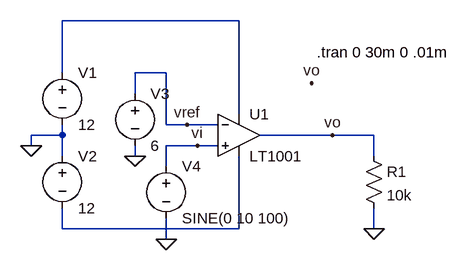
[diagram p0: schematic comparadores1.asc]
comparadores1.asc, the LTspice schematic file:
Version 4
SHEET 1 880 680
WIRE 176 16 -96 16
WIRE -96 96 -96 16
WIRE 64 96 16 96
WIRE 16 128 16 96
WIRE 176 160 176 16
WIRE 64 176 64 96
WIRE 96 176 64 176
WIRE 144 176 96 176
WIRE -96 192 -96 176
WIRE -96 192 -144 192
WIRE 320 192 208 192
WIRE 384 192 320 192
WIRE -144 208 -144 192
WIRE 112 208 64 208
WIRE 144 208 112 208
WIRE -96 224 -96 192
WIRE 16 224 16 208
WIRE 384 224 384 192
WIRE 64 240 64 208
WIRE -96 336 -96 304
WIRE 176 336 176 224
WIRE 176 336 -96 336
WIRE 384 336 384 304
WIRE 64 352 64 320
FLAG -144 208 0
FLAG 16 224 0
FLAG 64 352 0
FLAG 384 336 0
FLAG 320 192 vo
FLAG 288 112 vo
FLAG 96 176 vref
FLAG 112 208 vi
SYMBOL Opamps\\LT1001 176 128 R0
SYMATTR InstName U1
SYMBOL voltage -96 80 R0
WINDOW 123 0 0 Left 2
WINDOW 39 0 0 Left 2
SYMATTR InstName V1
SYMATTR Value 12
SYMBOL voltage -96 208 R0
WINDOW 123 0 0 Left 2
WINDOW 39 0 0 Left 2
SYMATTR InstName V2
SYMATTR Value 12
SYMBOL voltage 16 112 R0
WINDOW 123 0 0 Left 2
WINDOW 39 0 0 Left 2
SYMATTR InstName V3
SYMATTR Value 6
SYMBOL voltage 64 224 R0
WINDOW 123 0 0 Left 2
WINDOW 39 0 0 Left 2
SYMATTR InstName V4
SYMATTR Value SINE(0 10 100)
SYMBOL res 368 208 R0
SYMATTR InstName R1
SYMATTR Value 10k
TEXT 296 64 Left 2 !.tran 0 30m 0 .01m

The netlist it stands for:
* comparadores1.asc
XU1 vi vref N001 N002 vo LT1001  ; pins In+ In- V+ V- OUT
V1 N001 0 12
V2 0 N002 12
V3 vref 0 6
V4 vi 0 SINE(0 10 100)
R1 vo 0 10k
.tran 0 30m 0 .01m
.lib LTC.lib
.backanno
.end